# EasyEDA Pro project ProDoc_PCB.epro

# Board PCB
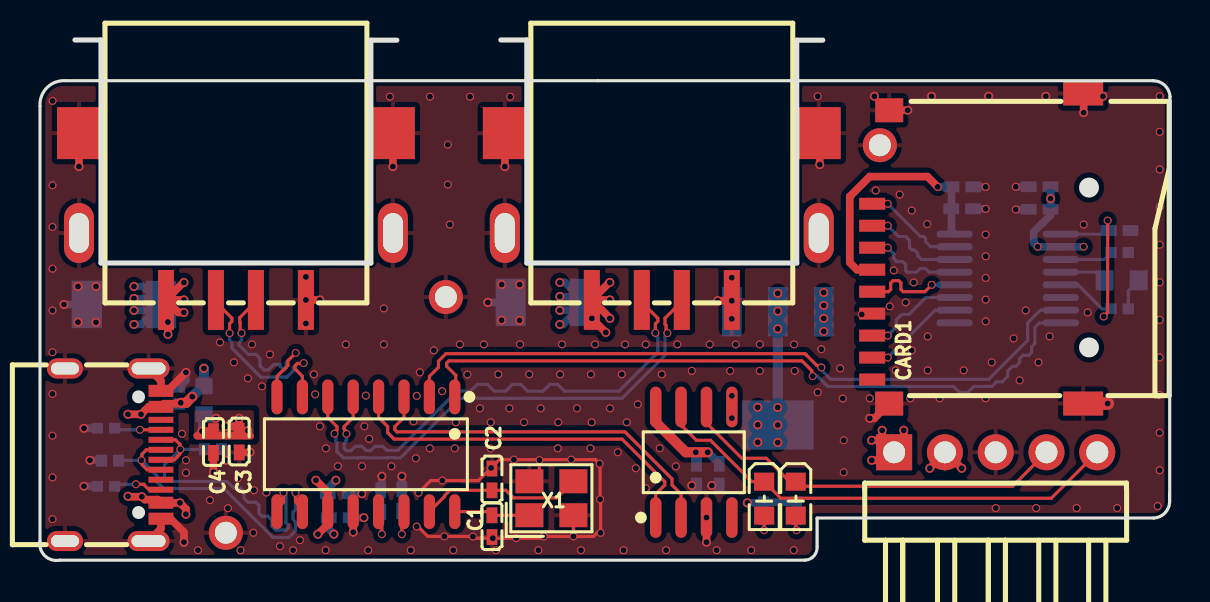
[diagram p0: board, top side]
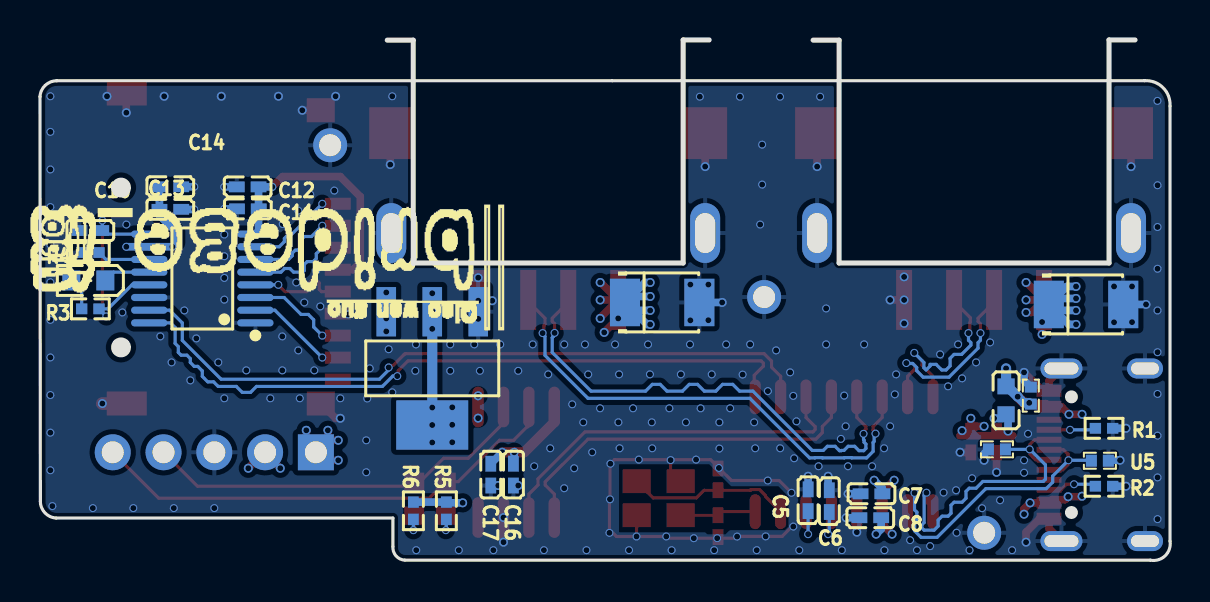
[diagram p1: board, bottom side, seen from below]

Outline 56.52 x 26.04 mm; copper layers: Top Layer, Inner1, Inner2, Bottom Layer. Coordinates in mm from the lower left corner of the outline.
Outline path: 55.68,24 1.28,24 arc(0.35,23.65) 0,22.73 0,0.95 arc(0.24,0.22) 0.99,0 38.27,0 arc(38.71,0.21) 38.87,0.68 38.87,2.11 55.71,2.11 arc(56.27,2.37) 56.5,2.94 56.52,23.21 arc(56.26,23.77) 55.68,23.99
Stack: Top Layer 0.035mm 外层铜厚1oz / Dielectric1 0.0994mm 3313 RC57% 4.2mil / Inner1 0.0152mm 内层铜厚 / Dielectric2 1.265mm 1.3mm H/HOZ Copper / Inner2 0.0152mm 内层铜厚 / Dielectric3 0.0994mm 3313 RC57% 4.2mil / Bottom Layer 0.035mm 外层铜厚1oz

## Design rules (mm)
net D+: d+-
net D-: d+-
net DN4: 4
net DP4: 4
net DN3: 3
net DP3: 3
net DN2: 2
net DP2: 2
net DN1: 1
net DP1: 1
template: 自定义配置
spacing copperThickness1oz (default): track to track 0.102, other pairs 0 to 0.3
spacing copperThickness2oz: track to track 0.203, other pairs 0.152 to 0.3
track width copperThickness2oz: min 0.203, default 0.254, max 2.54
track width 50欧姆 (default): min 0.127, default 0.157, max 2.54
differential pair differentialPair: width min 0.127, default 0.254, max 2.54; gap min 0.152, default 0.152
differential pair usb90欧 (default): width min 0.127, default 0.157, max 2.54; gap min 0.203, default 0.203
via viaSize (default): diameter min 0.399, default 0.399, max 10; hole min 0.3, default 0.3, max 6.299

## Placement (name value [footprint] x y rotation side)
C1  20pF  [C0402]  22.61 1.7 90 top
C2  20pF  [C0402]  22.61 4.04 90 top
C3  100nF  [C0402]  9.96 5.94 90 top
C4  10uF  [C0402]  8.68 5.91 90 top
C5  10uF  [C0402]  18.1 3 270 bottom
C6  10uF  [C0402]  17.04 2.95 270 bottom
C7  100nF  [C0402]  14.93 3.32 180 bottom
C8  10uF  [C0402]  14.99 2.12 180 bottom
C9  100uF  [CASE-B_3528]  25.4 12.9 180 bottom
C10  10uF  [C0402]  54 16.5 0 bottom
C11  100nF  [C0402]  46.12 17.58 180 bottom
C12  10uF  [C0402]  46.13 18.68 180 bottom
C13  100nF  [C0402]  50 17.56 0 bottom
C14  10uF  [C0402]  50 18.69 0 bottom
C15  100uF  [CASE-B_3528]  4.2 12.8 180 bottom
C16  100nF  [C0402]  32.84 4.28 90 bottom
C17  10uF  [C0402]  33.97 4.28 90 bottom
CARD1  TF-01A  [TF-SMD_TF-01A]  46.9 15.6 90 top
H1  拍针（弯）  [HDR-TH_5P-P2.54-H-M-W10.4]  47.8 5.4 0 top
LED1  A-SP192DGHC-C01-4T  [LED0603-FD]  54.1 14 180 bottom
LED2  A-SP192DGHC-C01-4T  [LED0603-FD]  36.22 3.08 90 top
LED3  A-SP192DGHC-C01-4T  [LED0603-FD]  37.8 3.08 90 top
R1  5.1kΩ  [R0402]  3.3 6.6 0 bottom
R2  5.1kΩ  [R0402]  3.3 3.7 0 bottom
R3  5.1kΩ  [R0402]  54 12.58 180 bottom
R4  100kΩ  [R0402]  54 15.4 0 bottom
R5  10kΩ  [R0402]  36.19 2.47 270 bottom
R6  10kΩ  [R0402]  37.84 2.47 270 bottom
TP1  -  [M1螺丝孔]  9.3 1.37 0 top
TP2  -  [M1螺丝孔]  20.3 13.17 0 top
TP3  -  [M1螺丝孔]  42.01 20.77 90 top
U1  GT-USB-7010ASV  [USB-C-SMD_G-SWITCH_GT-USB-7010ASV]  3.65 5.28 270 top
U2  UPZ1608U221-2R2TF  [L0603]  8.2 8 90 bottom
U3  ESD5451N  [DFN1006-2L-BI]  6.96 8.24 270 bottom
U4  SL2.1A  [SOP-16_L10.0-W3.9-P1.27-LS6.0-BL]  16.3 5.3 180 top
U5  ESD5451N  [DFN1006-2L-BI]  3.51 4.98 0 bottom
U6  ESD5451N  [DFN1006-2L-BI]  8.66 5.55 180 bottom
U8  GL823K-HCY04  [SSOP-16_L4.9-W3.9-P0.64-LS6.0-BL]  48.4 14.1 90 bottom
U9  CH340N  [SOP-8_L5.0-W4.0-P1.27-LS6.0-BL]  32.7 4.9 0 top
U10  AMS1117-3.3  [SOT-223-4_L6.5-W3.5-P2.30-LS7.0-BR]  36.9 9.6 90 bottom
USB1  U-A-24SD-W-2  [USB-A-SMD_U-A-24SD-W-2]  9.8 17.2 180 top
USB2  U-A-24SD-W-2  [USB-A-SMD_U-A-24SD-W-2]  31.1 17.2 180 top
X1  12MHz  [CRYSTAL-SMD_4P-L3.2-W2.5-BL]  25.58 3.1 0 top

## Footprints (pads in the part's own frame, mm; a bottom-side part is the same pattern mirrored in y, then rotated)
C0402
  rect 0.79x0.54 smd: 1(-0.545,0) 2(0.545,0)
CASE-B_3528
  rect 1.506x2.376 smd: 1(-1.861,0) 2(1.861,0)
CRYSTAL-SMD_4P-L3.2-W2.5-BL
  rect 1.4x1.2 smd: 1(-1.1,-0.85) 2(1.1,-0.85) 3(1.1,0.85) 4(-1.1,0.85)
DFN1006-2L-BI
  rect 0.55x0.6 smd: 1(-0.425,0) 2(0.425,0)
HDR-TH_5P-P2.54-H-M-W10.4
  rect 1.8x1.8 hole 1.1: 1(-5.08,0)
  round 1.8 hole 1.1: 2(-2.54,0) 3(0,0) 4(2.54,0) 5(5.08,0)
L0603
  rect 0.8x0.864 smd: 1(-0.7,0) 2(0.7,0)
LED0603-FD
  rect 0.9x1 smd: 1(-0.85,0) 2(0.85,0)
M1螺丝孔
  round 1.7 hole 1.1: 1(0,0)
R0402
  rect 0.566x0.54 smd: 1(-0.433,0) 2(0.433,0)
SOP-8_L5.0-W4.0-P1.27-LS6.0-BL
  oval 0.574x2.035 smd: 1(-1.905,-2.768) 2(-0.635,-2.768) 3(0.635,-2.768) 4(1.905,-2.768) 5(1.905,2.768) 6(0.635,2.768) 7(-0.635,2.768) 8(-1.905,2.768)
SOP-16_L10.0-W3.9-P1.27-LS6.0-BL
  oval 0.56x1.745 smd: 1(-4.445,-2.873) 2(-3.175,-2.873) 3(-1.905,-2.873) 4(-0.635,-2.873) 5(0.635,-2.873) 6(1.905,-2.873) 7(3.175,-2.873) 8(4.445,-2.873) 9(4.445,2.873) 10(3.175,2.873) 11(1.905,2.873) 12(0.635,2.873) 13(-0.635,2.873) 14(-1.905,2.873) 15(-3.175,2.873) 16(-4.445,2.873)
SOT-223-4_L6.5-W3.5-P2.30-LS7.0-BR
  rect 2.47x0.98 smd: 1(2.835,-2.3) 2(2.835,0) 3(2.835,2.3)
  rect 2.47x3.6 smd: 4(-2.835,0)
SSOP-16_L4.9-W3.9-P0.64-LS6.0-BL
  oval 0.355x1.815 smd: 1(-2.223,-2.655) 2(-1.587,-2.655) 3(-0.953,-2.655) 4(-0.318,-2.655) 5(0.318,-2.655) 6(0.953,-2.655) 7(1.587,-2.655) 8(2.223,-2.655) 9(2.223,2.655) 10(1.587,2.655) 11(0.953,2.655) 12(0.318,2.655) 13(-0.318,2.655) 14(-0.953,2.655) 15(-1.587,2.655) 16(-2.223,2.655)
TF-SMD_TF-01A
  rect 0.6x1.3 smd: 1(2.24,5.276) 2(1.14,5.276) 3(0.04,5.276) 4(-1.06,5.276) 5(-2.16,5.276) 6(-3.26,5.276) 7(-4.36,5.276) 8(-5.46,5.276) 9(-6.56,5.276)
  rect 1.2x1.4 smd: 10(-7.76,4.426) 13(6.92,4.426)
  rect 1.2x2 smd: 11(-7.76,-5.276) 12(7.76,-5.276)
USB-A-SMD_U-A-24SD-W-2
  rect 0.8x3 smd: 1(3.5,4.175) 2(1,4.175) 3(-1,4.175) 4(-3.5,4.175)
  oval 1.5x3 hole 1x2: 5(-7.85,0.825) 5(7.85,0.825)
  rect 2.2x2.6 smd: 5(-7.85,-4.175) 5(7.85,-4.175)
USB-C-SMD_G-SWITCH_GT-USB-7010ASV
  oval 1x2.1 hole 0.6x1.7: 1(-4.32,1.78) 2(4.32,1.78)
  oval 1x1.8 hole 0.6x1.4: 3(4.32,-2.4) 4(-4.32,-2.4)
  rect 0.6x1.24 smd: A1B12(-3.2,2.4) A4B9(-2.4,2.4) B1A12(3.2,2.4) B4A9(2.4,2.4)
  rect 0.3x1.24 smd: A5(-1.25,2.4) A6(-0.25,2.4) A7(0.25,2.4) A8(1.25,2.4) B5(1.75,2.4) B6(0.75,2.4) B7(-0.75,2.4) B8(-1.75,2.4)

## Nets
3V3: C16.2 C17.2 H1.2 R5.1 R6.1 U9.5 U9.8 U10.2 U10.4
+5V: C3.2 C4.2 C7.2 C8.2 C9.1 C13.2 C14.2 C15.1 H1.1 U2.1 U4.11 U8.10 U10.3 USB1.1 USB2.1
GND: C1.1 C2.2 C3.1 C4.1 C5.1 C6.1 C7.1 C8.1 C9.2 C10.2 C11.1 C12.1 C13.1 C14.1 C15.2 C16.1 C17.1 CARD1.6 CARD1.10 CARD1.11 CARD1.12 CARD1.13 H1.3 R1.1 R2.1 R4.2 TP1.1 TP2.1 TP3.1 U1.1 U1.2 U1.3 U1.4 U1.A1B12 U1.B1A12 U3.1 U4.12 U5.1 U6.1 U8.1 U8.14 U9.3 U10.1 USB1.4 USB1.5 USB2.4 USB2.5 X1.2 X1.4
VBUS: U1.A4B9 U1.B4A9 U2.2 U3.2
CLK: CARD1.5 U8.4
CMD: CARD1.3 U8.5
D0: CARD1.7 U8.3
D1: CARD1.8 U8.2
D2: CARD1.1 U8.7
D3: CARD1.2 U8.6
D+: U1.A6 U1.B6 U4.10 U5.2
D-: U1.A7 U1.B7 U4.9 U6.2
DN1: U4.7 USB1.2
DN2: U4.5 USB2.2
DN3: U4.3 U9.2
DN4: U4.1 U8.16
DP1: U4.8 USB1.3
DP2: U4.6 USB2.3
DP3: U4.4 U9.1
DP4: U4.2 U8.15
RXD: H1.5 LED2.2 U9.7
TF_VCC: C11.2 C12.2 CARD1.4 U8.8
TXD: H1.4 LED3.2 U9.6
$1N1582: R1.2 U1.A5
$1N1584: R2.2 U1.B5
$1N3612: C5.2 U4.14
$1N3616: C6.2 U4.13
$1N3732: C2.1 U4.15 X1.3
$1N4990: C10.1 R3.2 U8.9 U8.13
$1N5459: R4.1 U8.11
$1N5570: LED1.2 U8.12
$1N5612: LED1.1 R3.1
$1N9439: LED2.1 R5.2
$1N9485: LED3.1 R6.2
$1N13924: C1.2 U4.16 X1.1

Pads without a net: CARD1 9; U1 A8 B8; U9 4

## Via types
v1: diameter 0.45, hole 0.299, Top Layer to Bottom Layer, 109 vias
v2: diameter 0.399, hole 0.299, Top Layer to Bottom Layer, 218 vias

## Routing (per net, layer and track width the routed paths; a pad name or vN(x,y) marks a point on that pad's centre or on a via; arc(x,y) is an arc through that point)
3V3: length 16.6
  Top Layer w0.381: v1(44.5,4.6) 44.7,4.8 45.6,4.8 45.6,5.06 H1.2 45.3,5.4 v1(46.1,4.6)
  Top Layer w0.508: U9.8 30.79,6.91 32.3,5.4 v1(32.8,5.4) v1(33.4,5.4)
  Bottom Layer w0.381: 33.97,4.83 v1(33.4,5.4) ; v1(35.38,2.87) 36.16,2.87 R5.1 36.2,2.91 37.84,2.91 R6.1 ; C16.2 32.8,4.87 v1(32.8,5.4)
  Bottom Layer w0.508: v1(36.9,6.77) v1(36.9,7.64) v1(36.9,11.58) 36.9,12.44
  vias: v1(34.6,8.23) v1(34.6,7.11) v1(35.9,7.65) v1(35.9,6.78) v1(35.9,5.9) v1(36.9,13.36) v1(36.9,12.47) v1(36.9,5.89)
+5V: length 41.3
  Top Layer w0.381: USB2.1 28.47,13.9 v1(28.5,13.9) ; USB2.1 v1(27.6,12.1) v1(28.3,11.4) ; USB2.1 28.5,12.12 v1(28.5,12.1) ; USB2.1 v1(28.5,13.03) ; USB1.1 v1(7.2,13.03) ; USB1.1 7.17,13.9 v1(7.2,13.9) ; USB1.1 6.4,12.92 ; C3.2 v1(10.4,6.48) ; C3.2 9.94,6.46 9.7,6.7 v1(9.3,6.7) ; C3.2 v1(9.96,7.1) ; v1(43.2,6.5) 43.2,5.88 H1.1 42.72,5.5 42.22,6 ; v1(41.6,5) 42.02,5 ; 6.4,12.92 v1(6.4,11.92) v1(6.4,11.3) ; 6.4,12.92 6.92,12.4 v1(7.2,12.4) ; v1(13.8,4) 14.4,3.41 U4.11 14.4,1.8 v1(13.9,1.3) ; 10.51,6.23 7.87,6.23 7.87,6.24 ; C4.2 v1(8.1,6.46) ; v1(41.6,6) 42.22,6 ; 42.22,6 42.12,6.1 v1(42.12,6.5)
  Bottom Layer w0.381: C7.2 14.39,3.59 v1(14.8,4) ; 5.76,12.5 5.06,11.8 v1(4.7,11.8) ; 5.76,12.5 C15.1 ; 5.76,12.5 v1(4.7,12.5) ; C8.2 14.45,1.55 v1(14.7,1.3) ; v1(26,13.2) 26.96,13.2 26.26,13.9 v1(26,13.9) ; v1(8.1,6.46) 8.1,7.2 U2.1 8.4,7.1 v1(8.8,7.1) ; C9.1 26.86,12.5 ; 26.86,12.5 26.16,11.8 v1(26,11.8) ; 26.86,12.5 v1(26,12.5) ; v2(52.2,15.69) U8.10 v2(49.9,15.69) 49.7,15.89 49.7,16.43 50.11,16.84 50.13,16.84 50.54,17.26 C13.2 v1(50.54,18.1) C14.2 ; v1(4.7,13.7) 5.16,13.7 5.76,13.1 v1(4.7,13.1)
  vias: v1(39.2,13.4) v1(39.2,12.75) v1(39.2,12.1) v1(39.2,11.45)
GND: length 60.1
  Top Layer w0.158: v2(18.93,3.37) 19.55,3.99 v2(20.12,3.99) 21.93,3.99 v2(22.56,4.62) 22.98,5.03 v2(23.71,5.03) 24.95,5.03 v2(24.98,5.01) ; 21.7,1.13 21.74,1.1 v2(22.65,1.1) ; 21.7,1.13 v2(21.65,1.18) 21.55,1.18 ; 21.7,1.13 21.6,1.13 21.55,1.18 ; v2(26.68,1.19) 27.69,1.19 27.87,1.37 v2(28.04,1.37) 28.04,3.02 v2(28.01,3.05) 28.01,4.8 v2(27.99,4.83) 27.78,5.03 v2(26.57,5.03) 25,5.03 v2(24.98,5.01) ; v2(26.68,1.19) v2(25.19,1.19) 25.11,1.1 v2(23.82,1.1) 22.66,1.1 C1.1 ; v2(26.68,1.19) 26.68,2.24 X1.2 ; CARD1.6 41.58,12.3 v2(41.1,12.3) ; v2(24.98,5.01) 24.98,4.45 X1.4 ; 21.55,1.18 21.54,1.19 v2(20.22,1.19) 19.4,1.19 18.91,1.68 v2(18.84,1.68)
  Top Layer w0.381: v1(34.6,12.99) v1(33.9,12.99) ; v1(39,19.8) 39,21.33 USB2.5 ; v1(10.5,5.4) 10.49,5.39 C3.1 ; v1(52.2,22.4) 52.2,23.34 CARD1.12 ; v1(33.34,2.13) v1(33.34,0.9) ; USB1.5 v1(17.65,19.7) ; CARD1.13 v1(43.4,22.52) ; v1(7.2,0.9) 7.2,1.4 6.53,2.08 U1.B1A12 6.05,1.58 U1.2 ; v1(13.3,13.03) v1(14,13.03) ; 15.66,2.43 v1(15.66,1.4) ; v1(7.3,9.4) 6.38,8.47 U1.A1B12 6.05,8.97 U1.1 ; USB1.5 v1(1.95,19.7) ; C4.1 v1(8.68,4.4) ; CARD1.10 41.73,7.1 v1(41.5,7.1) ; USB2.5 v1(23.25,19.7)
  Top Layer w0.635: CARD1.11 v1(53.4,7.84)
  Bottom Layer w0.381: C9.2 v1(22.4,12.9) ; C6.1 17.1,3.56 v1(17.1,4.2) ; C16.1 v1(32.6,3.74) ; C15.2 v1(1.2,12.8) ; C17.1 v1(33.6,3.74) ; U6.1 9.3,5.33 v1(9.3,5) ; C7.1 v1(16.1,3.32) ; v1(7.3,9.4) 7.3,9 U3.1 ; 2.87,3.7 v1(2.2,3.7) ; C13.1 49.45,17.55 v2(48.8,17.55) ; C11.1 v2(47.3,17.58) ; 2.87,6.6 v1(2.2,6.6) ; C5.1 v1(18.1,4.2) ; C12.1 v2(47.3,18.68) ; v1(2.5,5) 3.06,5 U5.1 ; C8.1 v1(16.2,2.12) ; C14.1 v2(48.8,18.69)
  vias: v1(1.9,13.7) v1(1.9,11.92) v1(2.8,13.7) v1(2.8,11.91) v1(13.3,14.18) v1(13.3,11.85) v1(23.09,13.8) v1(23.09,12.01) v1(23.99,13.8) v1(23.99,12) v1(34.6,14.14) v1(34.6,12.08) v1(41.73,23.22) v1(44.59,23.22) v1(47.45,23.22) v1(50.31,23.22) v1(53.17,23.22) v2(0.63,22.99) v2(0.62,18.77) v2(0.62,16.68) v2(0.62,14.59) v2(0.62,12.5) v2(0.62,10.41) v2(0.62,8.32) v2(0.62,6.23) v2(0.62,4.14) v2(0.62,2.05) v2(7.1,6.32) v2(7.3,5) v2(7.3,4.38) v2(7.9,0.5) v2(8.5,3) v2(9,10.9) v2(9.4,2.6) v2(9.7,9.9) v2(9.9,4.1) v2(10.03,0.5) v2(10.4,9.1) v2(10.6,10.8) v2(10.7,3.5) v2(10.67,1.37) v2(11.1,8.7) v2(11.32,3.38) v2(11.5,10.3) v2(12,0.7) v2(12.66,0.5) v2(13,1) v2(13.7,9.3) v2(13.76,8.3) v2(14,6.7) v2(14.3,5.6) v2(14.29,0.5) v2(14.9,4.7) v2(15.3,10.8) v2(16.11,4.7) v2(16.22,6.7) v2(16.3,8.24) v2(16.41,0.5) v2(16.46,6.07) v2(17.2,12.6) v2(17.2,10.8) v2(17.5,23.2) v2(17.58,4.7) v2(18.54,0.5) v2(18.68,6.95) v2(18.84,8.22) v2(18.8,5.1) v2(19,9.4) v2(19.5,23.2) v2(19.5,5.6) v2(19.7,10.5) v2(20.11,8.46) v2(20.4,20.8) v2(20.4,18.8) v2(20.5,16.8) v2(20.75,5.6) v2(20.67,0.5) v2(20.8,6.9) v2(21,10.8) v2(21.38,9.29) v2(21.51,23.2) v2(22,7.6) v2(22.2,10.8) v2(22.54,6.9) v2(22.54,5.59) v2(22.8,0.5) v2(22.92,9.3) v2(23.52,23.2) v2(23.48,7.6) v2(24.01,10.8) v2(24.21,6.9) v2(24.47,9.3) v2(24.93,0.5) v2(25.04,7.6) v2(25.92,6.9) v2(25.9,5.6) v2(26.01,9.3) v2(26.11,10.8) v2(26.86,7.6) v2(27.06,0.5) v2(27.53,5.6) v2(27.56,9.3) v2(27.59,6.9) v2(27.76,10.8) v2(28.51,7.6) v2(28.9,5.4) v2(29.1,9.3) v2(29.19,0.5) v2(29.26,10.8) v2(29.35,6.9) v2(29.8,4.6) v2(29.9,7.8) v2(30.3,10.8) v2(30.3,3.6) v2(31,5.6) v2(31.1,9.3) v2(31.31,0.5) v2(31.8,4.7) v2(31.88,10.8) v2(32.6,9.48) v2(33.5,10.8) v2(33.84,0.5) v2(34.52,9.48) v2(34.8,10.8) v2(35.57,0.5) v2(36,10.8) v2(36,9.48) v2(37.71,10.8) v2(37.75,9.48) v2(37.7,0.5) v2(38.9,23.22) v2(38.9,8.4) v2(39.08,10.56) v2(40.03,9.6) v2(40.15,8.09) v2(40.2,6) v2(40.2,4.4) v2(41.5,8.1) v2(41.8,18.5) v2(42.5,12.7) v2(42.7,14.5) v2(42.8,9.5) v2(43,18.3) v2(43.3,12.9) v2(43.52,8.1) v2(43.6,17.5) v2(43.6,10.5) v2(43.7,13.9) v2(44.38,16.83) v2(44.4,11.2) v2(44.4,9.5) v2(45,8.1) v2(46.2,9.5) v2(47.3,16.3) v2(47.3,15.21) v2(47.3,14.13) v2(47.3,13.04) v2(47.3,11.95) v2(47.3,8.1) v2(47.6,9.9) v2(47.8,2.61) v2(48.7,11.1) v2(49,9) v2(49.3,12.5) v2(49.82,2.61) v2(49.94,9.9) v2(50.5,11.2) v2(51.85,2.61) v2(52.2,16.8) v2(52.4,12.4) v2(53.88,2.61) v2(55.9,2.71) v2(56,23.22) v2(56,21.44) v2(56,19.56) v2(56,17.67) v2(56,15.79) v2(56,13.91) v2(56,12.03) v2(56,10.15) v2(56,8.26) v2(56,6.38) v2(56,4.5)
VBUS: length 9.4
  Top Layer w0.381: v1(4.4,3.2) 4.42,3.18 v1(5.1,3.18) 5.24,3.03 5.89,3.03 U1.B4A9 ; 6.1,2.87 v1(7,2.87) 7.3,2.57 v1(7.3,2.3) ; v1(7.04,7.88) 6.86,7.88 6.81,7.83 6.21,7.83 U1.A4B9 5.43,7.67 v1(5.05,7.3) v1(4.4,7.3)
  Top Layer w0.508: v1(7.62,8.18) 7.31,7.88 v1(7.04,7.88)
  Bottom Layer w0.457: v1(7.62,8.18) 7.31,7.88 v1(7.04,7.88)
  Bottom Layer w0.508: v1(8.2,9.6) U2.2 8.13,8.7 v1(7.62,8.18)
CLK: length 5.1
  Top Layer w0.158: v2(44.6,13.78) 44.26,13.44 43.17,13.44 43.06,13.55 43.06,13.88 42.95,13.99 42.66,13.99 42.55,13.88 42.55,13.55 42.44,13.44 CARD1.5
  Bottom Layer w0.158: v2(44.6,13.78) U8.4
CMD: length 5.1
  Top Layer w0.158: CARD1.3 v2(42.4,15.64)
  Bottom Layer w0.158: v2(42.4,15.64) 42.7,15.34 42.7,15.1 42.85,14.95 43.15,14.95 43.3,14.8 43.3,14.5 43.38,14.42 43.84,14.42 44.02,14.6 44.28,14.6 44.46,14.42 U8.5
D0: length 5.1
  Top Layer w0.158: CARD1.7 v2(42.4,11.24)
  Bottom Layer w0.158: v2(42.4,11.24) 42.83,11.67 42.83,12.03 43.1,12.3 43.46,12.3 44.31,13.15 U8.3
D1: length 5.1
  Top Layer w0.158: CARD1.8 v2(42.4,10.14)
  Bottom Layer w0.158: v2(42.4,10.14) 44.77,12.51 U8.2
D2: length 5.1
  Top Layer w0.158: CARD1.1 v2(42.4,17.84)
  Bottom Layer w0.158: v2(42.4,17.84) 44.04,16.2 44.2,16.2 44.3,16.1 44.3,15.94 44.55,15.69 U8.7
D3: length 5.1
  Top Layer w0.158: CARD1.2 v2(42.4,16.74)
  Bottom Layer w0.158: v2(42.4,16.74) 42.94,16.2 43.3,16.2 43.49,16.01 43.49,15.65 43.62,15.52 43.75,15.52 43.9,15.37 43.9,15.24 44.09,15.05 U8.6
D+: length 16.5
  Top Layer w0.158: U1.B6 5.36,4.53 5.1,4.78 5.1,5.3 5.33,5.53 U1.A6 ; U4.10 13.12,2.58 12.78,2.92 v2(12.78,3.37)
  Bottom Layer w0.158: U5.2 3.96,5 v2(5.08,5) 5.87,4.21 5.87,3.9 6.19,3.58 9.21,3.58 11.65,1.14 12.45,1.14 12.77,1.46 12.77,1.92 12.66,2.03 12.66,2.4 12.78,2.52 v2(12.78,3.37)
D-: length 16.5
  Top Layer w0.158: v2(12.18,3.38) 12.18,2.9 11.85,2.58 U4.9 ; U1.B7 6.78,6.03 7,5.8 7,5.31 6.87,5.18 6.87,5.17 6.72,5.03 U1.A7
  Bottom Layer w0.158: v2(7.02,5.55) U6.2 ; v2(12.18,3.38) 12.3,3.26 12.3,1.88 12.41,1.77 12.41,1.61 12.3,1.5 11.8,1.5 11.6,1.7 11.6,2 11.4,2.2 11.1,2.2 10.96,2.34 10.96,2.75 10.8,2.9 10.4,2.9 10.2,3.1 10.2,3.44 10.05,3.6 9.7,3.6 9.36,3.94 6.34,3.94 6.23,4.05 6.23,4.77 7.02,5.56
DN1: length 9.6
  Top Layer w0.158: 9.48,11.38 9.48,11.83 9.6,11.95 9.6,12.11 9.16,12.55 9.12,12.55 8.8,12.88 USB1.2 ; U4.7 13.12,9.2 12.76,9.57 12.76,9.74 12.87,9.85 13.17,9.85 v2(13.19,9.87)
  Bottom Layer w0.158: v2(9.48,11.37) 9.48,11.01 9.6,10.89 9.6,10.61 11.05,9.16 12.35,9.16 12.67,9.48 12.67,9.65 12.87,9.85 13.17,9.85 v2(13.19,9.87)
DN2: length 24.9
  Top Layer w0.158: USB2.2 30.1,12.88 30.42,12.55 30.46,12.55 30.9,12.11 30.9,11.95 30.78,11.83 v2(30.78,11.38) ; 15.66,8.17 15.66,7.14 15.21,6.69 15.21,6.56 15.26,6.51 15.26,6.39 v2(15.33,6.32)
  Bottom Layer w0.158: v2(30.78,11.38) 30.85,11.31 30.85,11.19 30.9,11.14 30.9,10.4 28.96,8.46 26.23,8.46 25.89,8.8 25.5,8.8 25.16,8.46 24.38,8.46 24.04,8.8 23.63,8.8 23.29,8.46 22.72,8.46 22.38,8.8 21.87,8.8 21.53,8.46 20.86,8.46 17.89,5.49 17.35,5.49 17.14,5.7 16.75,5.7 16.53,5.48 16.45,5.48 16.43,5.49 16.31,5.49 16.1,5.7 15.77,5.7 15.55,5.48 15.32,5.48 15.21,5.59 15.21,5.81 15.3,5.9 15.3,6 15.33,6.03 v2(15.33,6.32)
DN3: length 18.8
  Top Layer w0.158: U9.2 32.06,3.31 31.61,3.76 31.61,4.07 29.26,6.42 17.86,6.42 17.75,6.53 17.75,6.69 18.21,7.14 U4.3
DN4: length 35.8
  Top Layer w0.158: U4.1 20.79,8.22 20.79,9.25 20.34,9.71 20.34,9.86 20.45,9.98 38.11,9.98 38.6,9.49 38.6,9.26 v2(38.65,9.21)
  Bottom Layer w0.158: U8.16 49.99,11.88 49.76,11.65 49.76,10.85 49.6,10.69 49.6,10.4 49.46,10.26 49.17,10.26 49,10.09 49,9.89 48.81,9.7 48.63,9.7 48.4,9.47 48.4,9.2 48.13,8.93 47.84,8.93 47.61,8.7 46.7,8.7 46.4,8.4 45.98,8.4 45.69,8.7 39.39,8.7 38.88,9.21 v2(38.65,9.21)
DP1: length 9.6
  Top Layer w0.158: U4.8 11.85,9.2 12.4,9.75 12.4,9.99 v2(12.79,10.38) ; v2(10.08,11.37) 10.01,11.43 10.01,11.89 9.99,11.91 9.99,12.14 10.8,12.95 USB1.3
  Bottom Layer w0.158: v2(12.79,10.38) 12.31,9.89 12.31,9.63 12.2,9.52 12,9.72 12,9.8 11.7,9.8 11.42,9.52 11.2,9.52 11,9.72 11,10.1 10.8,10.3 10.42,10.3 9.96,10.76 9.96,10.89 10.08,11.01 v2(10.08,11.37)
DP2: length 24.9
  Top Layer w0.158: U4.6 14.4,7.14 14.85,6.69 14.85,6.5 14.73,6.38 v2(14.73,6.33) ; USB2.3 32.1,12.95 31.26,12.11 31.26,11.81 31.31,11.75 31.31,11.43 v2(31.38,11.37)
  Bottom Layer w0.158: v2(14.73,6.33) 14.8,6.27 14.8,5.95 14.85,5.89 14.85,5.44 15.17,5.12 15.92,5.12 15.93,5.13 16.28,5.13 16.3,5.12 17.39,5.12 17.4,5.13 17.76,5.13 17.77,5.12 18.03,5.12 21.01,8.1 29.11,8.1 31.26,10.25 31.26,11.2 31.38,11.32 v2(31.38,11.37)
DP3: length 18.8
  Top Layer w0.158: U4.4 16.94,7.14 17.39,6.69 17.39,6.38 17.71,6.06 29.11,6.06 31.25,3.92 31.25,3.76 30.79,3.31 U9.1
DP4: length 35.8
  Top Layer w0.158: U4.2 19.47,9.2 19.93,9.66 19.93,9.96 20.3,10.34 38.26,10.34 38.31,10.29 38.31,10.29 38.86,9.75 38.93,9.75 39.02,9.65 v2(39.08,9.65)
  Bottom Layer w0.158: v2(39.08,9.65) 39.08,9.52 39.54,9.06 47.46,9.06 49.4,11 49.4,11.88 50.04,12.51 U8.15
RXD: length 24.2
  Top Layer w0.158: H1.5 50.58,3.1 37.05,3.1 LED2.2 35.6,3.93 33.53,6 32.83,6 32.15,6.68 32.12,6.68 32.06,6.73 U9.7
TF_VCC: length 12.7
  Top Layer w0.381: CARD1.4 40.86,14.54 40.5,14.9 40.5,18.2 41.5,19.2 44.38,19.2 v2(44.9,18.68)
  Bottom Layer w0.381: v2(44.9,18.68) C12.2 45.59,16.48 U8.8
TXD: length 19.8
  Top Layer w0.158: H1.4 48.64,3.7 38.03,3.7 LED3.2 37.5,3.93 36.33,5.1 35.1,5.1 33.34,6.86 33.34,7.67
$1N1582: length 2.3
  Top Layer w0.158: U1.A5 v2(5,6.53)
  Bottom Layer w0.158: R1.2 3.81,6.53 v2(5,6.53)
$1N1584: length 2.5
  Top Layer w0.158: U1.B5 5.45,3.53 5.2,3.78 5.2,3.8 v2(4.8,3.8)
  Bottom Layer w0.158: v2(4.8,3.8) 3.83,3.8 R2.2
$1N3612: length 2.3
  Top Layer w0.158: U4.14 18.1,2.32 v2(18.1,1.3)
  Bottom Layer w0.158: C5.2 v2(18.1,1.3)
$1N3616: length 2.3
  Top Layer w0.158: U4.13 17.1,2.26 v2(17.1,1.3)
  Bottom Layer w0.158: v2(17.1,1.3) 17.04,1.36 C6.2
$1N3732: length 8.2
  Top Layer w0.158: X1.3 25.85,3.12 23.68,3.12 23.3,3.5 C2.1 20.99,3.5 20.96,3.53 20.53,3.53 20.23,3.23 20.23,3.19 U4.15
$1N4990: length 11.4
  Top Layer w0.158: v2(53.4,17) 53.4,12.4 v2(53.2,12.2)
  Bottom Layer w0.158: U8.9 53.28,16.32 C10.1 53.4,16.56 v2(53.4,17) ; U8.13 51.92,13.78 53.12,12.58 R3.2 53.57,12.57 v2(53.2,12.2)
$1N5459: length 2.7
  Bottom Layer w0.158: U8.11 53.22,15.05 R4.1
$1N5570: length 2.4
  Bottom Layer w0.158: U8.12 52.83,14.42 LED1.2
$1N5612: length 1.6
  Bottom Layer w0.158: LED1.1 54.43,13.48 R3.1
$1N9439: length 1.3
  Top Layer w0.158: LED2.1 v2(36.22,1.5)
  Bottom Layer w0.158: R5.2 36.19,1.53 v2(36.22,1.5)
$1N9485: length 1.3
  Top Layer w0.158: v2(37.84,1.5) 37.8,1.54 LED3.1
  Bottom Layer w0.158: R6.2 v2(37.84,1.5)
$1N13924: length 3.8
  Top Layer w0.158: U4.16 22.42,2.43 C1.2 24.47,2.25 X1.1

## Copper pours and planes (outline as drawn; the poured copper is in the pictures)
3V3 on Inner2: 32.49,8.51 49.31,8.51 49.31,2.59 32.49,2.59
+5V on Top Layer: 7.71,7.5 10.7,7.5 10.7,6.04 7.71,6.04
+5V on Inner2: 0.26,23.74 56.26,23.74 56.26,0.26 0.26,0.26
GND on Top Layer: -13.8,29.9 58.2,29.9 58.2,-6.5 -13.8,-6.5
GND on Bottom Layer: -0.9,29.4 71.5,29.4 71.5,-8.4 -0.9,-8.4
GND on Inner1: 0.25,23.75 56.26,23.75 56.26,0.26 0.25,0.26
VBUS on Inner2: 3.49,10.2 8.91,10.2 8.91,1.79 3.49,1.79

Small or netless copper shapes (teardrops, artwork), in the pictures only: 39 on Inner1, 6 on Inner2
